# Altium schematic sheet MCU_STM32F407ZGT6.SchDoc: STM32F446 CNC
size C; Author: AM; CompanyName: Expatria Technologies; DrawnBy: A.Marles; Engineer: AM; Organization: Expatria Technologies; DocumentNumber: 3; SheetNumber: 3; SheetTotal: 14
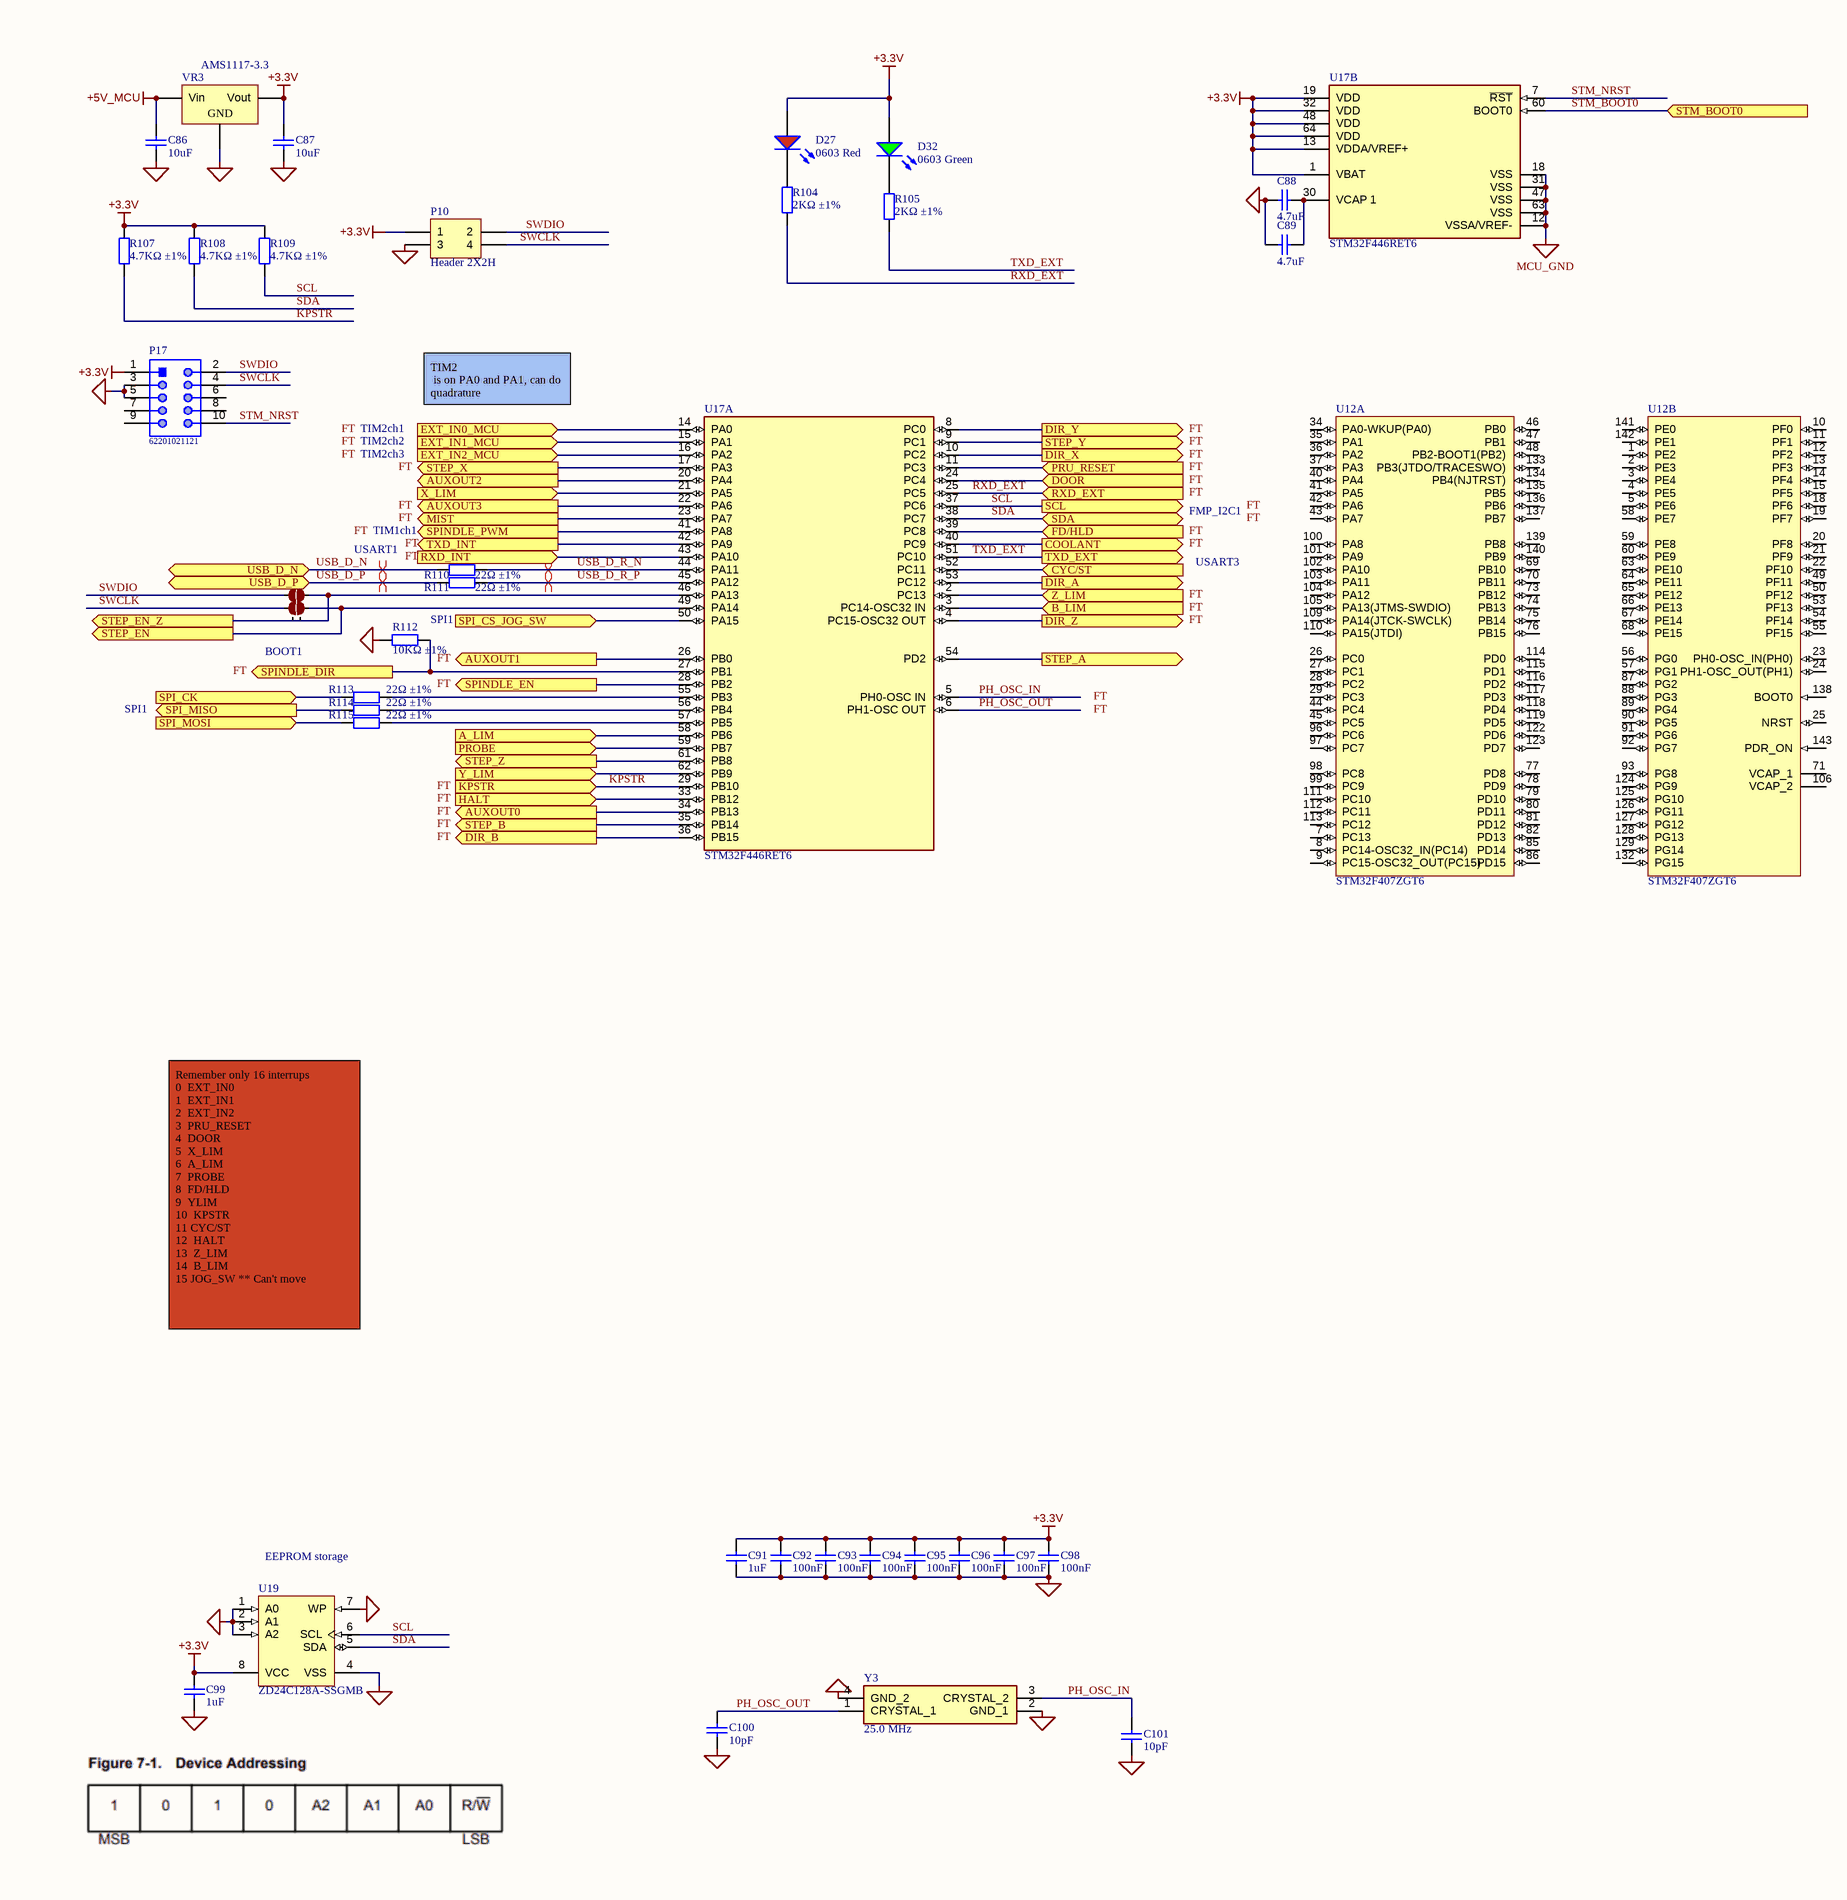
[diagram p0: MCU_STM32F407ZGT6.SchDoc, left]
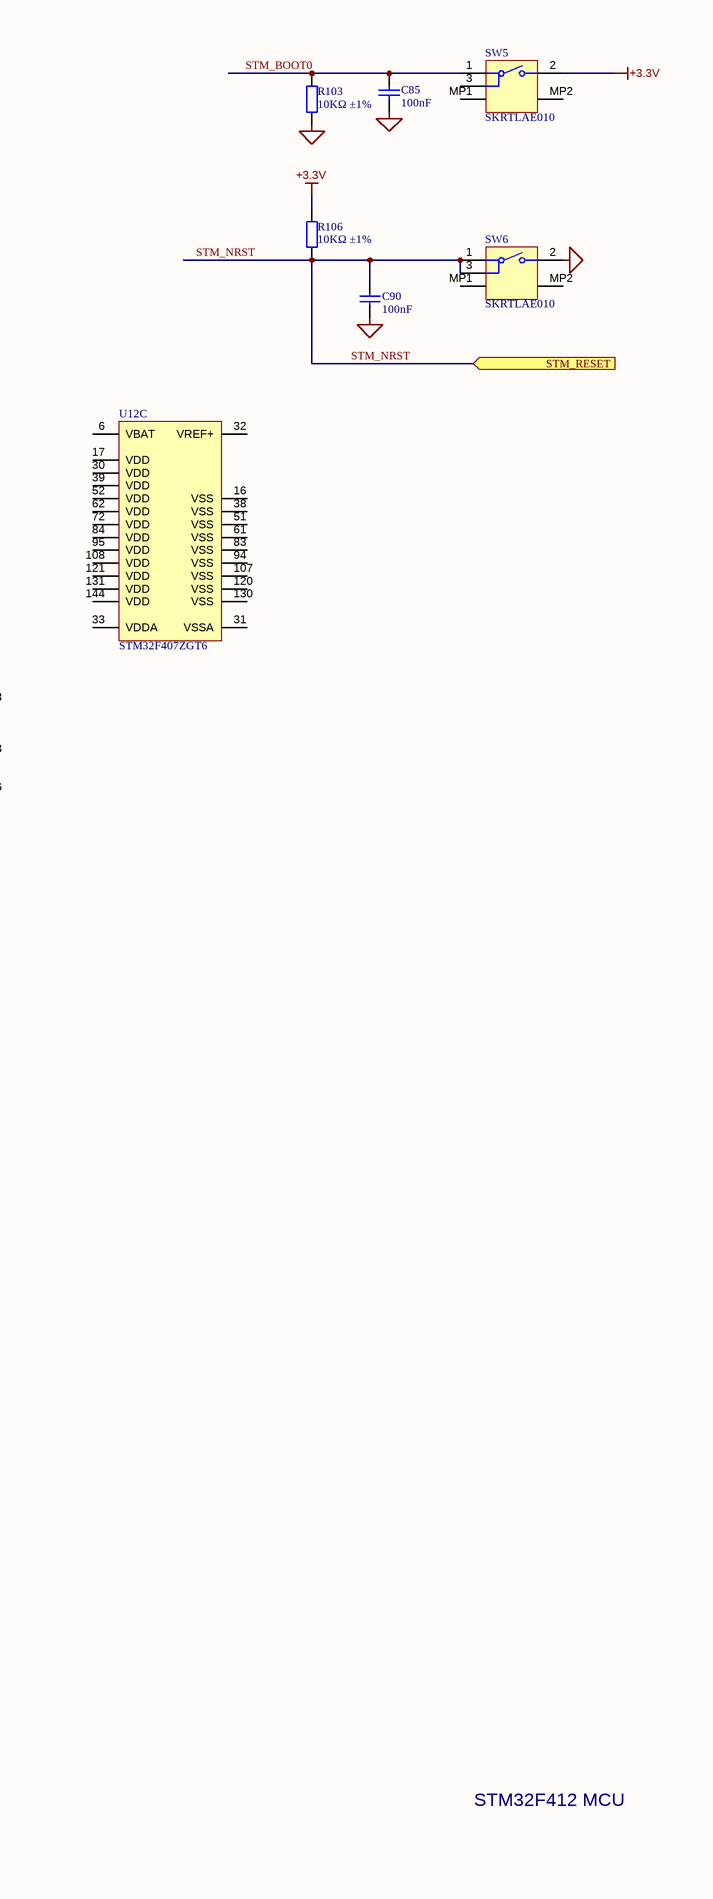
[diagram p1: MCU_STM32F407ZGT6.SchDoc, right]

## Parts
C85  100nF  [0603_C]
C86  10uF  [1206_C]
C87  10uF  [1206_C]
C88  4.7uF  [0603_C]
C89  4.7uF  [0603_C]
C90  100nF  [0603_C]
C91  1uF  [0603_C]
C92  100nF  [0603_C]
C93  100nF  [0603_C]
C94  100nF  [0603_C]
C95  100nF  [0603_C]
C96  100nF  [0603_C]
C97  100nF  [0603_C]
C98  100nF  [0603_C]
C99  1uF  [0603_C]
C100  10pF  [0603_C]
C101  10pF  [0603_C]
D27  0603 Red  [0603_LED_S1]
D32  0603 Green  [0603_LED_S1]
J17  2 way net solder junction - Normally Open  [2waySolder_NO]  (value not drawn)  (no BOM)
J18  2 way net solder junction - Normally Open  [2waySolder_NO]  (value not drawn)  (no BOM)
P10  Header 2X2H  [HDR2X2H]  (no BOM)
P17  62201021121  [62201021121]  (no BOM)
R103  10KΩ ±1%  [0603_R]
R104  2KΩ ±1%  [0603_R]
R105  2KΩ ±1%  [0603_R]
R106  10KΩ ±1%  [0603_R]
R107  4.7KΩ ±1%  [0603_R]
R108  4.7KΩ ±1%  [0603_R]
R109  4.7KΩ ±1%  [0603_R]
R110  22Ω ±1%  [0603_R]
R111  22Ω ±1%  [0603_R]
R112  10KΩ ±1%  [0603_R]
R113  22Ω ±1%  [0603_R]
R114  22Ω ±1%  [0603_R]
R115  22Ω ±1%  [0603_R]
SW5  SKRTLAE010  [ALPS-SKRTLAE010_V]
SW6  SKRTLAE010  [ALPS-SKRTLAE010_V]
U12  STM32F407ZGT6  [STM-LQFP144_L]  (parts A,B,C of 3)
U17  STM32F446RET6  [FP-LQFP64-5W-IPC_B]  (parts A,B of 2)
U19  ZD24C128A-SSGMB  [SOIC-SN8_L]
VR3  AMS1117-3.3  [SOT-223]
Y3  25.0 MHz  [YSX321SL]

## Ports
A_LIM (in), AUXOUT0 (out), AUXOUT1 (out), AUXOUT2 (out), AUXOUT3 (out), B_LIM (in), COOLANT (out), CYC/ST (in), DIR_A (out), DIR_B (out), DIR_X (out), DIR_Y (out), DIR_Z (out), DOOR (in), EXT_IN0_MCU (in), EXT_IN1_MCU (in), EXT_IN2_MCU (in), FD/HLD (in), HALT (in), KPSTR (in), MIST (out), PROBE (in), PRU_RESET (in), RXD_EXT (in), RXD_INT (in), SCL (out), SDA (bidir), SPI_CK (in), SPI_CS_JOG_SW (in), SPI_MISO (out), SPI_MOSI (in), SPINDLE_DIR (out), SPINDLE_EN (out), SPINDLE_PWM (out), STEP_A (out), STEP_B (out), STEP_EN (out), STEP_EN_Z (out), STEP_X (out), STEP_Y (out), STEP_Z (out), STM_BOOT0 (in), STM_RESET (in), TXD_EXT (out), TXD_INT (out), USB_D_N (bidir), USB_D_P (bidir), X_LIM (in), Y_LIM (in), Z_LIM (in)

## Nets
+3.3V: C87.2 C91.2 C92.2 C93.2 C94.2 C95.2 C96.2 C97.2 C98.2 C99.2 D27.A D32.A P10.1 P17.1 R106.1 R107.2 R108.2 R109.2 SW5.2 U17.1(VBAT) U17.13(VDDA/VREF+) U17.19(VDD) U17.32(VDD) U17.48(VDD) U17.64(VDD) U19.8(VCC) VR3.2(Vout)
+5V_MCU: C86.2 VR3.3(Vin)
MCU_GND: C85.1 C86.1 C87.1 C88.1 C89.1 C90.1 C91.1 C92.1 C93.1 C94.1 C95.1 C96.1 C97.1 C98.1 C99.1 C100.1 C101.1 P10.3 P17.3 P17.5 R103.2 R112.1 SW6.2 U17.12(VSSA/VREF-) U17.18(VSS) U17.31(VSS) U17.47(VSS) U17.63(VSS) U19.1(A0) U19.2(A1) U19.3(A2) U19.4(VSS) U19.7(WP) VR3.1(GND) Y3.2(GND_1) Y3.4(GND_2)
A_LIM: U17.58(PB6) ; port A_LIM
AUXOUT0: U17.34(PB13) ; port AUXOUT0
AUXOUT1: U17.26(PB0) ; port AUXOUT1
AUXOUT2: U17.20(PA4) ; port AUXOUT2
AUXOUT3: U17.22(PA6) ; port AUXOUT3
B_LIM: U17.3(PC14-OSC32_IN) ; port B_LIM
COOLANT: U17.40(PC9) ; port COOLANT
CYC/ST: U17.52(PC11) ; port CYC/ST
DIR_A: U17.53(PC12) ; port DIR_A
DIR_B: U17.36(PB15) ; port DIR_B
DIR_X: U17.10(PC2) ; port DIR_X
DIR_Y: U17.8(PC0) ; port DIR_Y
DIR_Z: U17.4(PC15-OSC32_OUT) ; port DIR_Z
DOOR: U17.24(PC4) ; port DOOR
EXT_IN0_MCU: U17.14(PA0) ; port EXT_IN0_MCU
EXT_IN1_MCU: U17.15(PA1) ; port EXT_IN1_MCU
EXT_IN2_MCU: U17.16(PA2) ; port EXT_IN2_MCU
FD/HLD: U17.39(PC8) ; port FD/HLD
HALT: U17.33(PB12) ; port HALT
KPSTR: R107.1 U17.29(PB10) ; port KPSTR
MIST: U17.23(PA7) ; port MIST
PH_OSC_IN: C101.2 U17.5(PH0-OSC_IN) Y3.3(CRYSTAL_2)
PH_OSC_OUT: C100.2 U17.6(PH1-OSC_OUT) Y3.1(CRYSTAL_1)
PROBE: U17.59(PB7) ; port PROBE
PRU_RESET: U17.11(PC3) ; port PRU_RESET
RXD_EXT: R104.1 U17.25(PC5) ; port RXD_EXT
RXD_INT: U17.43(PA10) ; port RXD_INT
SCL: R109.1 U17.37(PC6) U19.6(SCL) ; port SCL
SDA: R108.1 U17.38(PC7) U19.5(SDA) ; port SDA
SPI_CK: R113.2 ; port SPI_CK
SPI_CS_JOG_SW: U17.50(PA15) ; port SPI_CS_JOG_SW
SPI_MISO: R114.2 ; port SPI_MISO
SPI_MOSI: R115.2 ; port SPI_MOSI
SPINDLE_DIR: R112.2 U17.27(PB1) ; port SPINDLE_DIR
SPINDLE_EN: U17.28(PB2) ; port SPINDLE_EN
SPINDLE_PWM: U17.41(PA8) ; port SPINDLE_PWM
STEP_A: U17.54(PD2) ; port STEP_A
STEP_B: U17.35(PB14) ; port STEP_B
STEP_EN: J18.2 U17.49(PA14) ; port STEP_EN
STEP_EN_Z: J17.2 U17.46(PA13) ; port STEP_EN_Z
STEP_X: U17.17(PA3) ; port STEP_X
STEP_Y: U17.9(PC1) ; port STEP_Y
STEP_Z: U17.61(PB8) ; port STEP_Z
STM_BOOT0: C85.2 R103.1 SW5.1 U17.60(BOOT0) ; port STM_BOOT0
STM_NRST: C90.2 P17.10 R106.2 SW6.1 SW6.3 U17.7(~{RST}) ; port STM_RESET
SWCLK: J18.1 P10.4 P17.4
SWDIO: J17.1 P10.2 P17.2
TXD_EXT: R105.1 U17.51(PC10) ; port TXD_EXT
TXD_INT: U17.42(PA9) ; port TXD_INT
USB_D_N: R110.2 ; port USB_D_N
USB_D_P: R111.2 ; port USB_D_P
USB_D_R_N: R110.1 U17.44(PA11)
USB_D_R_P: R111.1 U17.45(PA12)
X_LIM: U17.21(PA5) ; port X_LIM
Y_LIM: U17.62(PB9) ; port Y_LIM
Z_LIM: U17.2(PC13) ; port Z_LIM
NetC88_2: C88.2 C89.2 U17.30(VCAP_1)
NetD27_K: D27.K R104.2
NetD32_K: D32.K R105.2
NetR113_1: R113.1 U17.55(PB3)
NetR114_1: R114.1 U17.56(PB4)
NetR115_1: R115.1 U17.57(PB5)

Not connected (* = marked no-connect by the designer): P17 6 7 8 9; SW5 3 MP1 MP2; SW6 MP1 MP2; U12 1(PE2) 2(PE3) 3(PE4) 4(PE5) 5(PE6) 6(VBAT) 7(PC13) 8(PC14-OSC32_IN(PC14)) 9(PC15-OSC32_OUT(PC15)) 10(PF0) 11(PF1) 12(PF2) 13(PF3) 14(PF4) 15(PF5) 16(VSS) 17(VDD) 18(PF6) 19(PF7) 20(PF8) 21(PF9) 22(PF10) 23(PH0-OSC_IN(PH0)) 24(PH1-OSC_OUT(PH1)) 25(NRST) 26(PC0) 27(PC1) 28(PC2) 29(PC3) 30(VDD) 31(VSSA) 32(VREF+) 33(VDDA) 34(PA0-WKUP(PA0)) 35(PA1) 36(PA2) 37(PA3) 38(VSS) 39(VDD) 40(PA4) 41(PA5) 42(PA6) 43(PA7) 44(PC4) 45(PC5) 46(PB0) 47(PB1) 48(PB2-BOOT1(PB2)) 49(PF11) 50(PF12) 51(VSS) 52(VDD) 53(PF13) 54(PF14) 55(PF15) 56(PG0) 57(PG1) 58(PE7) 59(PE8) 60(PE9) 61(VSS) 62(VDD) 63(PE10) 64(PE11) 65(PE12) 66(PE13) 67(PE14) 68(PE15) 69(PB10) 70(PB11) 71(VCAP_1) 72(VDD) 73(PB12) 74(PB13) 75(PB14) 76(PB15) 77(PD8) 78(PD9) 79(PD10) 80(PD11) 81(PD12) 82(PD13) 83(VSS) 84(VDD) 85(PD14) 86(PD15) 87(PG2) 88(PG3) 89(PG4) 90(PG5) 91(PG6) 92(PG7) 93(PG8) 94(VSS) 95(VDD) 96(PC6) 97(PC7) 98(PC8) 99(PC9) 100(PA8) 101(PA9) 102(PA10) 103(PA11) 104(PA12) 105(PA13(JTMS-SWDIO)) 106(VCAP_2) 107(VSS) 108(VDD) 109(PA14(JTCK-SWCLK)) 110(PA15(JTDI)) 111(PC10) 112(PC11) 113(PC12) 114(PD0) 115(PD1) 116(PD2) 117(PD3) 118(PD4) 119(PD5) 120(VSS) 121(VDD) 122(PD6) 123(PD7) 124(PG9) 125(PG10) 126(PG11) 127(PG12) 128(PG13) 129(PG14) 130(VSS) 131(VDD) 132(PG15) 133(PB3(JTDO/TRACESWO)) 134(PB4(NJTRST)) 135(PB5) 136(PB6) 137(PB7) 138(BOOT0) 139(PB8) 140(PB9) 141(PE0) 142(PE1) 143(PDR_ON) 144(VDD)

## Layout directives
differential pair: USB_D_N, USB_D_P, USB_D_R_N, USB_D_R_P

## Notes on the sheet
- TIM2
  is on PA0 and PA1, can do quadrature
- FT
- TIM2ch1
- TIM2ch2
- TIM2ch3
- TIM1ch1
- FMP_I2C1
- USART1
- USART3
- BOOT1
- (near R112) SPI1
- (near R112) FT
- SPI1
- Remember only 16 interrups
  0  EXT_IN0
  1  EXT_IN1
  2  EXT_IN2
  3  PRU_RESET
  4  DOOR
  5  X_LIM
  6  A_LIM
  7  PROBE
  8  FD/HLD
  9  YLIM
  10  KPSTR
  11 CYC/ST
  12  HALT
  13  Z_LIM
  14  B_LIM
  15 JOG_SW ** Can't move
- (near U19) EEPROM storage
- STM32F412 MCU
- Expatria Technologies
- SHEET
- PROJECT
- REV
- 1136 Glade Court
- Port Coquitlam, BC V3B 1R5
- EMAIL: INFO@EXPATRIA.CA
- SIZE
- ENGR
- C
- MODIFIED
- DOCUMENT
- /
- Copyright Expatria Technologies 2021.  This document describes Open Hardware and is licensed under the CERN-OHL-P  v2.  No warranty is implied or expressed.

## Library data of the parts
C85 C90 C92-C98 = 0603 100nF (104) 10% 50V: Chip capacitors; Manufacturer: YAGEO; PartNumber: CC0603KRX7R9BB104; Tolerance: 10%; Voltage: 50V; ComponentLink1Description: Supplier link; ComponentLink1URL: http://www.szlcsc.com/product/details_15331.html; Package: 0603; Supplier: LC; SuppliersPartNumber: C14663; Capacitance: 100nF
C86 C87 = 1206 10uF (106) 10% 50V: Chip capacitors; Manufacturer: Samsung Electro-Mechanics; PartNumber: CL31A106KBHNNNE; Tolerance: 10%; Voltage: 50V; ComponentLink1Description: Supplier link; ComponentLink1URL: http://www.szlcsc.com/product/details_14236.html; Package: 1206; Supplier: LC; SuppliersPartNumber: C13585; Capacitance: 10uF; Manufacturer 1: Samsung Electro-Mechanics
C88 C89 = 0603 4.7uF (475) 10% 16V: Chip capacitors; Manufacturer: Samsung Electro-Mechanics; PartNumber: CL10A475KO8NNNC; Tolerance: 10%; Voltage: 16V; ComponentLink1Description: Supplier link; ComponentLink1URL: http://www.szlcsc.com/product/details_20375.html; Package: 0603; Supplier: LC; SuppliersPartNumber: C19666; Capacitance: 4.7uF
C91 C99 = 0603 1uF (105) 10% 50V: Chip capacitors; Manufacturer: Samsung Electro-Mechanics; PartNumber: CL10A105KB8NNNC; Tolerance: 10%; Voltage: 50V; ComponentLink1Description: Supplier link; ComponentLink1URL: http://www.szlcsc.com/product/details_16531.html; Package: 0603; Supplier: LC; SuppliersPartNumber: C15849; Capacitance: 1uF
C100 C101 = 0603 10pF (100) 5% 50V: Chip capacitors; Manufacturer: Samsung Electro-Mechanics; PartNumber: CL10C100JB8NNNC; Tolerance: 5%; Voltage: 50V; ComponentLink1Description: Supplier link; ComponentLink1URL: http://www.szlcsc.com/product/details_1986.html; Package: 0603; Supplier: LC; SuppliersPartNumber: C1634; Capacitance: 10pF
D27 = 0603 LED Red: LED; ComponentLink1Description: 供应商链接; ComponentLink1URL: http://www.szlcsc.com/product/details_2659.html; Package: 0603; Supplier: LC; SuppliersPartNumber: C2286; Color: Red
D32 = 0603 LED Green: LED; ComponentLink1Description: 供应商链接; ComponentLink1URL: http://www.szlcsc.com/product/details_73152.html; Package: 0603; Supplier: LC; SuppliersPartNumber: C72043; Color: Green
J17 J18 = 2waySolderNO: ComponentLink1URL: http://www.edatools.cz/addons; ComponentLink1Description: Source
P10 = Header 2X2H: Header, 2-Pin, Dual row, Right Angle; LatestRevisionDate: 17-Jul-2002; LatestRevisionNote: Re-released for DXP Platform.; Publisher: Altium Limited; SuppliersPartNumber: C66690
P17 = CMP-1502-00948-1: THT Vertical Pin Header WR-PHD, Pitch 1.27 mm, Dual Row, 10 pins; Manufacturer: Wurth Elektronik; Rated Current: 1A; Pin Number: 10; Working Voltage: 100VAC; Contact Resistance: 20mOhm; Withstanding Voltage: 500VAC; Pitch: 1.27mm; Gender: Male; Mounting Technology: THT; Manufacturer URL: http://www.we-online.de; Package Reference: 62201021121; Row Number: Dual; Datasheet URL: https://katalog.we-online.de/em/datasheet/62201021121.pdf; Publisher: WurthElektronik; Packaging: Box; Operating Temperature: -40to105degC; Orientation: Vertical; Part Number: 62201021121
R103 R106 R112 = 0603 10K (1002) 1%: Chip resistor; Manufacturer: Uniroyal Elec; PartNumber: 0603WAF1002T5E; Power: 1/10W; ComponentLink1Description: Supplier link; ComponentLink1URL: http://www.szlcsc.com/product/details_26547.html; Package: 0603; Supplier: LC; SuppliersPartNumber: C25804; Resistance: 10KΩ; Tolerance: 1%
R104 R105 = 0603 2K (2001) 1%: Chip resistor; Manufacturer: Uniroyal Elec; PartNumber: 0603WAF2001T5E; Power: 1/10W; ComponentLink1Description: Supplier link; ComponentLink1URL: http://www.szlcsc.com/product/details_23702.html; Package: 0603; Supplier: LC; SuppliersPartNumber: C22975; Resistance: 2KΩ; Tolerance: 1%
R107-R109 = 0603 4.7K (4701) 1%: Chip resistor; Manufacturer: Uniroyal Elec; PartNumber: 0603WAF4701T5E; Power: 1/10W; ComponentLink1Description: Supplier link; ComponentLink1URL: http://www.szlcsc.com/product/details_23889.html; Package: 0603; Supplier: LC; SuppliersPartNumber: C23162; Resistance: 4.7KΩ; Tolerance: 1%
R110 R111 R113-R115 = 0603 22R (22R0) 1%: Chip resistor; Manufacturer: Uniroyal Elec; PartNumber: 0603WAF220JT5E; Power: 1/10W; ComponentLink1Description: Supplier link; ComponentLink1URL: http://www.szlcsc.com/product/details_24078.html; Package: 0603; Supplier: LC; SuppliersPartNumber: C23345; Resistance: 22Ω; Tolerance: 1%
SW5 SW6 = CMP-2000-07073-2: Side Push Type, 250 V, -40 to 90 degC, 3-Pin SMD, RoHS, Tape and Reel; Manufacturer: ALPS; Operating Force: 1.6N; Folder: Unified Components\Components\New Releases\New\; Maximum Current Rating: 0.05@12VDCA; RevisionId: 1; Pole Throw Configuration: SPST; Switch Configuration: N.O.; AccessRights: 2147483647; Maximum DC Voltage Rating: 12V; ContentType: Unified Component; Rad Hard: No; Mounting: SurfaceMount; Datasheet URL: http://www.alps.com/prod/info/E/PDF/Tact/SurfaceMount/SKRT/SKRT.PDF; Manufacturer URL: http://www.alps.com/e/; ReleaseDate: 22/09/2017 06:13:25 AM; ItemHRID: CMP-2000-07073; ContentTypeGUID: CB3C11C4-E317-11DF-B822-12313F0024A2; LifeCycle: Released; ItemGUID: EAC55BEC-37DC-4BDB-8BA7-D75E6D5C3D75; Packaging: Tape&Reel; Package Reference: SKRTLAE010; FolderGUID: B7F4506A-9127-42E7-A087-46FE7B18D116; Datasheet Version: 06/2015; Mounting Technology: SurfaceMount; LifeCycleStateGUID: 61E382EE-6656-4F12-9E24-BE9327104A25; Package Description: 3-Pin Surface Mount Device, Body 4.5 x 3.55 mm, Pitch 1.225 mm; SuppliersPartNumber: C110293; Manufacturer 1: ALPS
U12 = STM32F407ZGT6: ARM® Cortex®-M4 STM32F4 Microcontroller IC 32-Bit Single-Core 168MHz 1MB (1M x 8) FLASH 144-LQFP (20x20); Manufacturer: STMicroelectronics; PartNumber: STM32F407ZET6; Core: ARM Cortex-M4; Operating Frequency(F) (Processor speed) (MHz): 168; Supply Voltage(Vcc) max (V): 3.6; D/A Converter: 2x12-bit; Packing: Tray; I/Os (High Current): 114; Supply Voltage(Vcc) min (V): 1.8; FLASH Size (Prog) (kB): 512; Internal RAM Size (kB): 192; ComponentLink1Description: Manufacturer URL; ComponentLink1URL: http://www.st.com/web/en/home.html; PackageReference: LQFP144; PackageDescription: 144-Pin Low Profile Quad Flat Package, 20 x 20 mm Body, 0.5 mm Pitch; ComponentLink2URL: http://www.st.com/st-web-ui/static/active/en/resource/technical/document/datasheet/DM00037051.pdf; ComponentLink2Description: Datasheet; ComponentLink3Description: Package Specification; ComponentLink3URL: http://www.st.com/st-web-ui/static/active/en/resource/technical/document/datasheet/DM00037051.pdf; Mounting Technology: Surface Mount; DatasheetVersion: Rev. 4; PackageVersion: Rev. 4, 06/2013
U17 = STM32F446RET6: IC MCU 32BIT 512KB FLASH 64LQFP; Manufacturer: STMicroelectronics; Number Of Spi Channels: 4; Ram Size: 128KBytes; Standoff Height: 0.05mm; Number Of Uart Channels: 6; Number Of Pwm Channels: 32; Max Junction Temp: +105°C; Number Of I/Os: 50; Number Of Usb Channels: 2; Frequency: 180MHz; Number Of A/D Converters: 3; Max Supply Voltage: 3.6V; Number Of Adc Channels: 16; Interface: I2C,SPI,UART,USART,CAN,USB,LIN,IrDA,I2S,Other; Memory Size: 512KBytes; Number Of Timers/Counters: 14; Min Supply Voltage: 1.7V; Core Architecture: ARM Cortex-M4; Data Bus Width: 32bits; Number Of Cores: 1; Consigned: Y; Ambient Temperature Range Low: -40°C; ComponentLink2URL: https://www.st.com/en/microcontrollers-microprocessors/stm32f446re.html; Category: IC; Height: 1.6mm; Ipc Land Pattern Name: QFP50P1200X1200X160-64; Octopart: https://octopart.com/stm32f446ret6-stmicroelectronics-52642920; Temperature Range High: +105°C; Lead Free: Yes; Mouser Description: ARM Microcontrollers - MCU High-performance and DSP with FP, ARM Cortex-M4 MCU with 512 Kbytes Flash, 180 MHz CPU, Art Accelerator, SDRAM; Digikey Description: IC MCU 32BIT 512KB FLASH 64LQFP; Ambient Temperature Range High: +85°C; Number Of I2C Channels: 4; Memory Type: FLASH; RoHS: TRUE; Automotive: No; Device Class L1: Integrated Circuits (ICs); Temperature: -40°C to +105°C; Device Class L2: Embedded Processors and Controllers; Device Class L3: Microcontrollers; Temperature Range Low: -40°C; Package: LQFP64-5W; ComponentLink2Description: Datasheet; Manufacturer 1: STMicroelectronics; Manufacturer Part Number 1: STM32F446RET6; SuppliersPartNumber: C69336
U19 = CMP-0159-00216-1: IC EEPROM 128KBIT I2C 8SOIC; SuppliersPartNumber: C918271
VR3 = SOT-223 AMS1117-3.3: Vout=3.3V 1A 72dB@(120Hz) (LDO); Manufacturer 1: AMS; ComponentLink1Description: 供应商链接; ComponentLink1URL: http://www.szlcsc.com/product/details_6652.html; Package: SOT-223; Supplier: LC; SuppliersPartNumber: C6186; Manufacturer Part Number 1: AMS1117-3.3
Y3 = YSX321SL: Crystal or Oscillator; Manufacturer_Name: Yangxing Tech; Manufacturer_Part_Number: X322525MSB4SI; Height: 0.8mm; SuppliersPartNumber: C13740